# Altium schematic sheet Top_schematic.SchDoc
size A4; DocumentNumber: 6; SheetNumber: 1; SheetTotal: 11
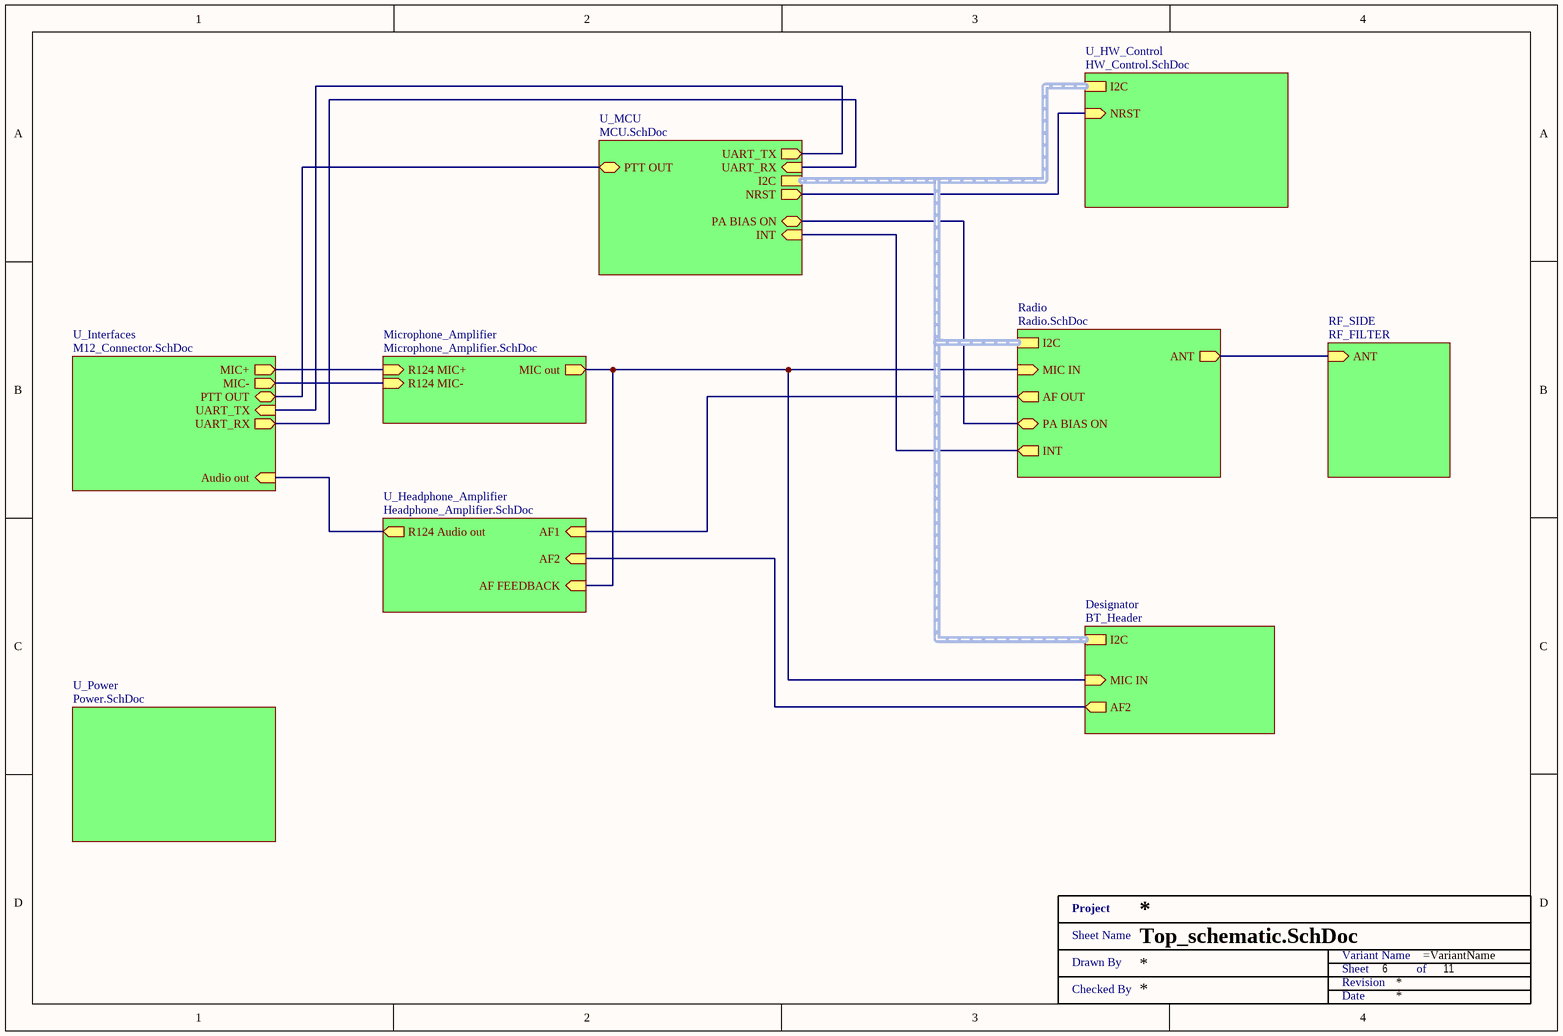
[diagram p0: Top_schematic.SchDoc]

## Parts
XX?  Title 1  (value not drawn)  (graphical)

## Sub-sheets
Designator = BT_Header: I2C, AF2 (out), MIC IN (in)
Microphone_Amplifier = Microphone_Amplifier.SchDoc: R124 MIC+ (in), R124 MIC- (in), MIC out (out)
Radio = Radio.SchDoc: I2C (harness I2C), AF OUT (out), MIC IN (in), PA BIAS ON (bidir), ANT (out), INT (out)
RF_SIDE = RF_FILTER: ANT (in)
U_Headphone_Amplifier = Headphone_Amplifier.SchDoc: AF1 (in), R124 Audio out (out), AF2 (in), AF FEEDBACK (in)
U_HW_Control = HW_Control.SchDoc: I2C (harness I2C), NRST (in)
U_Interfaces = M12_Connector.SchDoc: MIC+ (out), MIC- (out), Audio out (in), PTT OUT (bidir), UART_TX (in), UART_RX (out)
U_MCU = MCU.SchDoc: UART_TX (out), UART_RX (in), PTT OUT (bidir), I2C, NRST (out), PA BIAS ON (bidir), INT (in)
U_Power = Power.SchDoc: no entries

## Nets
(unnamed): sheet Microphone_Amplifier/R124 MIC+, sheet U_Interfaces/MIC+
(unnamed): sheet Microphone_Amplifier/R124 MIC-, sheet U_Interfaces/MIC-
(unnamed): sheet Microphone_Amplifier/MIC out, sheet U_Headphone_Amplifier/AF FEEDBACK, sheet Designator/MIC IN, sheet Radio/MIC IN
(unnamed): sheet RF_SIDE/ANT, sheet Radio/ANT
(unnamed): sheet U_MCU/UART_TX, sheet U_Interfaces/UART_TX
(unnamed): sheet U_MCU/UART_RX, sheet U_Interfaces/UART_RX
(unnamed): sheet U_MCU/PTT OUT, sheet U_Interfaces/PTT OUT
(unnamed): sheet U_MCU/NRST, sheet U_HW_Control/NRST
(unnamed): sheet U_MCU/PA BIAS ON, sheet Radio/PA BIAS ON
(unnamed): sheet U_MCU/INT, sheet Radio/INT
(unnamed): sheet U_Interfaces/Audio out, sheet U_Headphone_Amplifier/R124 Audio out
(unnamed): sheet U_Headphone_Amplifier/AF1, sheet Radio/AF OUT
(unnamed): sheet U_Headphone_Amplifier/AF2, sheet Designator/AF2

## Buses and harness runs
harness sheet Designator/I2C = sheet Radio/I2C = sheet U_HW_Control/I2C = sheet U_MCU/I2C

## Notes on the sheet
- (in symbol Title 1) Project; Sheet Name; Variant Name; Drawn By; Sheet; of; Revision; Checked By; Date